# EAGLE schematic Display_v5 (EAGLE 9.7.0)
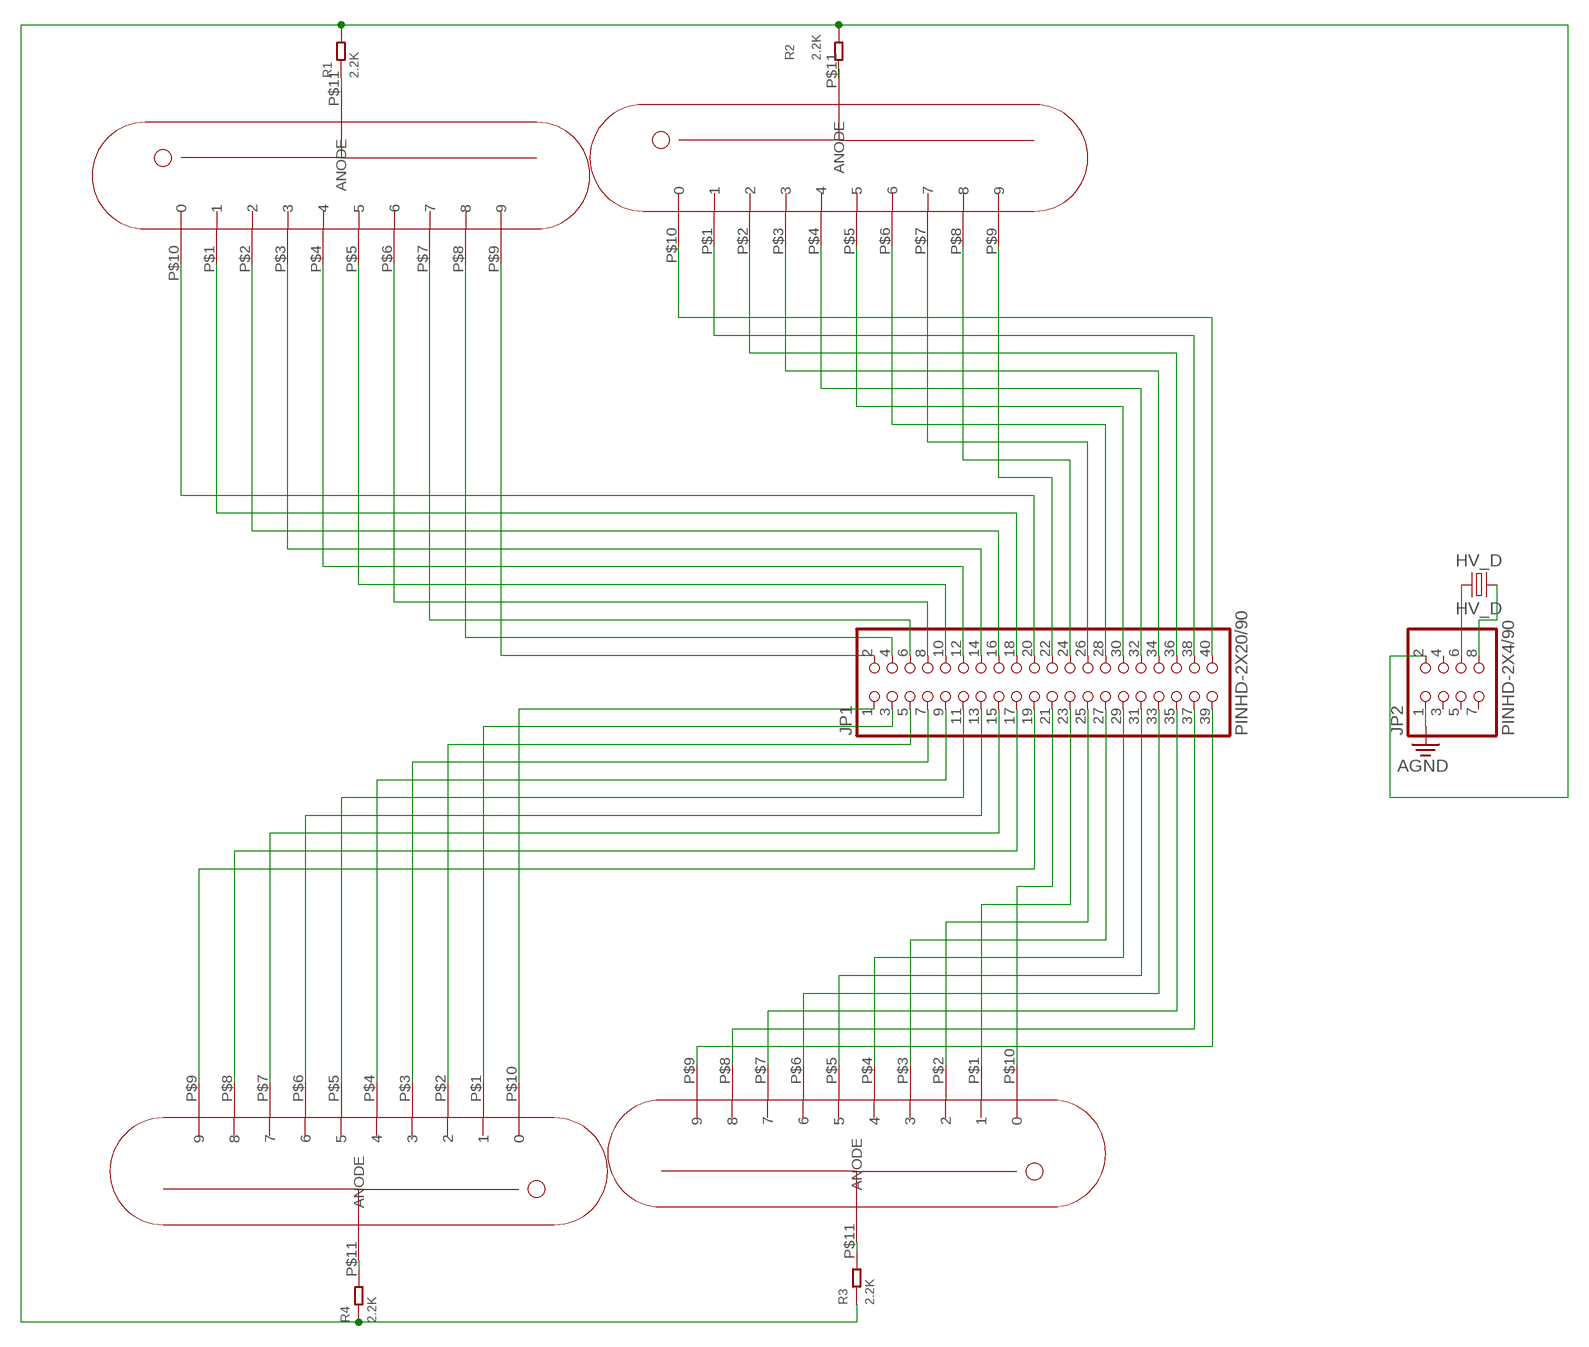
[diagram p0: schematic, sheet 1]

## Parts
HV_D  HV_D  CRYSTAL_HC49-11L-13.5H  [XTALRR488W43L1135T465H1346B]
JP1  PINHD-2X20/90  [2X20/90]
JP2  PINHD-2X4/90  [2X04/90]
R1  2.2K  DIP-RES-2.2K-5%-1/4W(PR-D2.3XL6.5MM)  [PR-D2.3XL6.5MM]
R2  2.2K  DIP-RES-2.2K-5%-1/4W(PR-D2.3XL6.5MM)  [PR-D2.3XL6.5MM]
R3  2.2K  DIP-RES-2.2K-5%-1/4W(PR-D2.3XL6.5MM)  [PR-D2.3XL6.5MM]
R4  2.2K  DIP-RES-2.2K-5%-1/4W(PR-D2.3XL6.5MM)  [PR-D2.3XL6.5MM]
U$1  IN-12  [IN-12]
U$2  IN-12  [IN-12]
U$3  IN-12  [IN-12]
U$4  IN-12  [IN-12]

## Nets
AGND: JP2.1
N$2: JP1.23 U$4.P$1
N$3: JP1.39 U$4.P$9
N$5: JP1.4 U$1.P$8
N$6: JP1.6 U$1.P$7
N$11: JP1.40 U$2.P$10
N$12: JP1.22 U$2.P$9
N$21: JP1.19 U$3.P$9
N$22: JP1.17 U$3.P$8
N$23: JP1.15 U$3.P$7
N$24: JP1.13 U$3.P$6
N$25: JP1.11 U$3.P$5
N$26: JP1.9 U$3.P$4
N$27: JP1.7 U$3.P$3
N$28: JP1.5 U$3.P$2
N$29: JP1.3 U$3.P$1
N$30: JP1.1 U$3.P$10
N$41: HV_D.2 JP2.8
N$42: HV_D.1 JP2.6
N$43: JP1.14 U$1.P$3
N$44: JP1.16 U$1.P$2
N$45: R1.1 U$1.P$11(ANODE)
N$46: R2.1 U$2.P$11(ANODE)
N$47: R3.2 U$4.P$11(ANODE)
N$48: R4.2 U$3.P$11(ANODE)
N$49: JP2.2 R1.2 R2.2 R3.1 R4.1
N$50: JP1.18 U$1.P$1
N$51: JP1.20 U$1.P$10
N$52: JP1.38 U$2.P$1
N$53: JP1.36 U$2.P$2
N$54: JP1.34 U$2.P$3
N$56: JP1.24 U$2.P$8
N$57: JP1.26 U$2.P$7
N$58: JP1.28 U$2.P$6
N$59: JP1.30 U$2.P$5
N$60: JP1.32 U$2.P$4
N$61: JP1.2 U$1.P$9
N$64: JP1.8 U$1.P$6
N$65: JP1.10 U$1.P$5
N$66: JP1.12 U$1.P$4
N$77: JP1.37 U$4.P$8
N$78: JP1.35 U$4.P$7
N$79: JP1.33 U$4.P$6
N$80: JP1.31 U$4.P$5
N$81: JP1.29 U$4.P$4
N$82: JP1.27 U$4.P$3
N$83: JP1.25 U$4.P$2
N$85: JP1.21 U$4.P$10
Unconnected: JP2.3 JP2.4 JP2.5 JP2.7

## Library data of the parts
HV_D = Frequency-Source:CRYSTAL: Crystal 2Pin - Generic; CATEGORY: Crystals; PACKAGE_SIZE: HC-49/US; PACKAGE_TYPE: THT
JP1 = Connector:PINHD-2X20: PIN HEADER; CATEGORY: Headers; DESCRIPTION: Header, Right Angle, 2x20 Position; MANUFACTURER: Generic; MPN: Generic; OPERATING_TEMPERATURE: Generic; PART_STATUS: Active; PITCH: 0.100" (2.54mm); ROHS_COMPLIANCE: Generic; SERIES: Generic; SUB-CATEGORY: Headers, Male Pins; TYPE: Board to Board or Cable, Unshrouded, Through Hole, Right Angle
JP2 = Connector:PINHD-2X4: PIN HEADER; CATEGORY: Headers; DESCRIPTION: Header, Right Angle, 2x4 Position; MANUFACTURER: Generic; MPN: Generic; OPERATING_TEMPERATURE: Generic; PART_STATUS: Active; PITCH: 0.100" (2.54mm); ROHS_COMPLIANCE: Generic; SERIES: Generic; SUB-CATEGORY: Headers, Male Pins; TYPE: Board to Board or Cable, Unshrouded, Through Hole, Right Angle
R1-R4 = OPL_Resistor:DIP-RES-2.2K-5%-1/4W(PR-D2.3XL6.5MM): 301020010; MPN: FHCFR-1/4W-222J
U$1-U$4 = IN-12:IN-12